# EAGLE schematic ext (EAGLE 6.4)
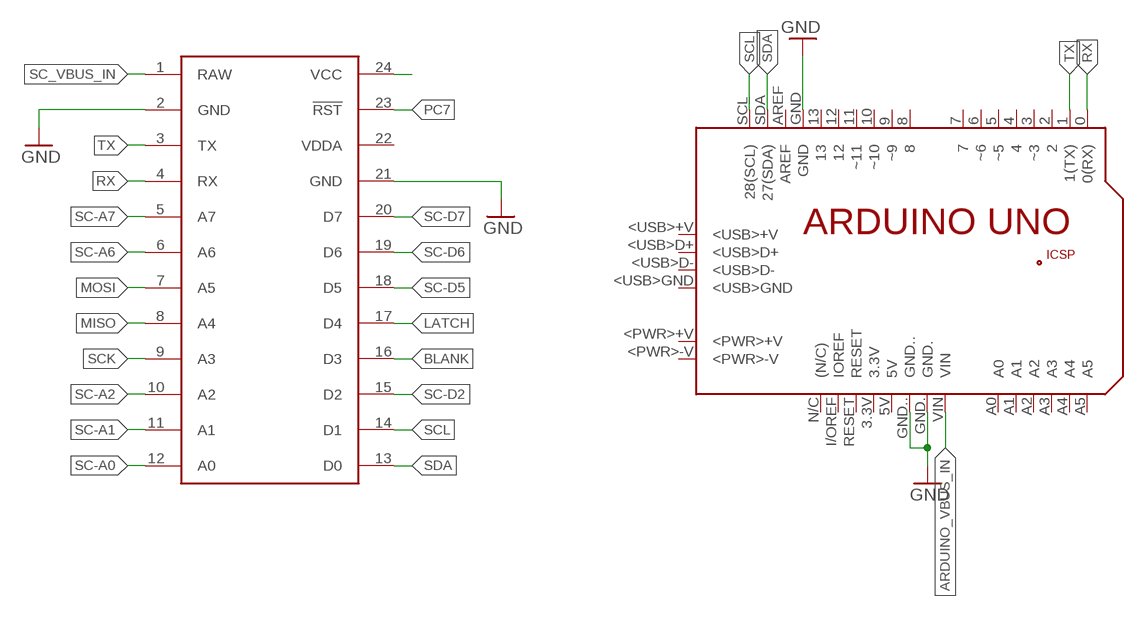
[diagram p0: schematic, sheet 1]

## Parts
PCB1  ARDUINO_UNO  [ARDUINO_UNO]
SC1  SPARK_CORECORE  [SPARK_CORE]

## Nets
ARDUINO_VBUS_IN: PCB1.VIN
BLANK: SC1.16(D3)
GND: PCB1.GND PCB1.GND. PCB1.GND.. SC1.2(GND) SC1.21(GND)
LATCH: SC1.17(D4)
MISO: SC1.8(A4)
MOSI: SC1.7(A5)
N$8: SC1.24(VCC)
PC7: SC1.23(!RST)
RX: PCB1.0(0(RX)) SC1.4(RX)
SC-A0: SC1.12(A0)
SC-A1: SC1.11(A1)
SC-A2: SC1.10(A2)
SC-A6: SC1.6(A6)
SC-A7: SC1.5(A7)
SC-D2: SC1.15(D2)
SC-D5: SC1.18(D5)
SC-D6: SC1.19(D6)
SC-D7: SC1.20(D7)
SC_VBUS_IN: SC1.1(RAW)
SCK: SC1.9(A3)
SCL: PCB1.SCL(28(SCL)) SC1.14(D1)
SDA: PCB1.SDA(27(SDA)) SC1.13(D0)
TX: PCB1.1(1(TX)) SC1.3(TX)
Unconnected: PCB1.2 PCB1.3(~3) PCB1.3.3V PCB1.4 PCB1.5(~5) PCB1.5V PCB1.6(~6) PCB1.7 PCB1.8 PCB1.9(~9) PCB1.10(~10) PCB1.11(~11) PCB1.12 PCB1.13 PCB1.+5V PCB1.<PWR>+V PCB1.<PWR>-V PCB1.<USB>+V PCB1.<USB>D+ PCB1.<USB>D- PCB1.<USB>GND PCB1.A0 PCB1.A1 PCB1.A2 PCB1.A3 PCB1.A4 PCB1.A5 PCB1.AREF PCB1.GND_ PCB1.I/OREF(IOREF) PCB1.MISO PCB1.MOSI PCB1.N/C((N/C)) PCB1.RESET PCB1.RESET. PCB1.SCK

## Power pins joined to a net without a drawn wire
VDDA: SC1.22(VDDA)

## Library data of the parts
PCB1 = E14_Arduino:ARDUINO_UNO: Device for representing an Arduino Uno board with a footprint in an EAGLE design. Created by Dave Young for Element14. More EAGLE documentation at: http://www.element14.com/community/community/knode/cadsoft_eagle
SC1 = Spark:SPARK_CORE